# EasyEDA schematic Turbin.json

## Sheets
1 Default_Set: TITLE: Sheet_1; REV: 1.0; Date: 2024-07-22; Sheet: 1/1; Drawn By: ulirberdulham; Company: Your Company
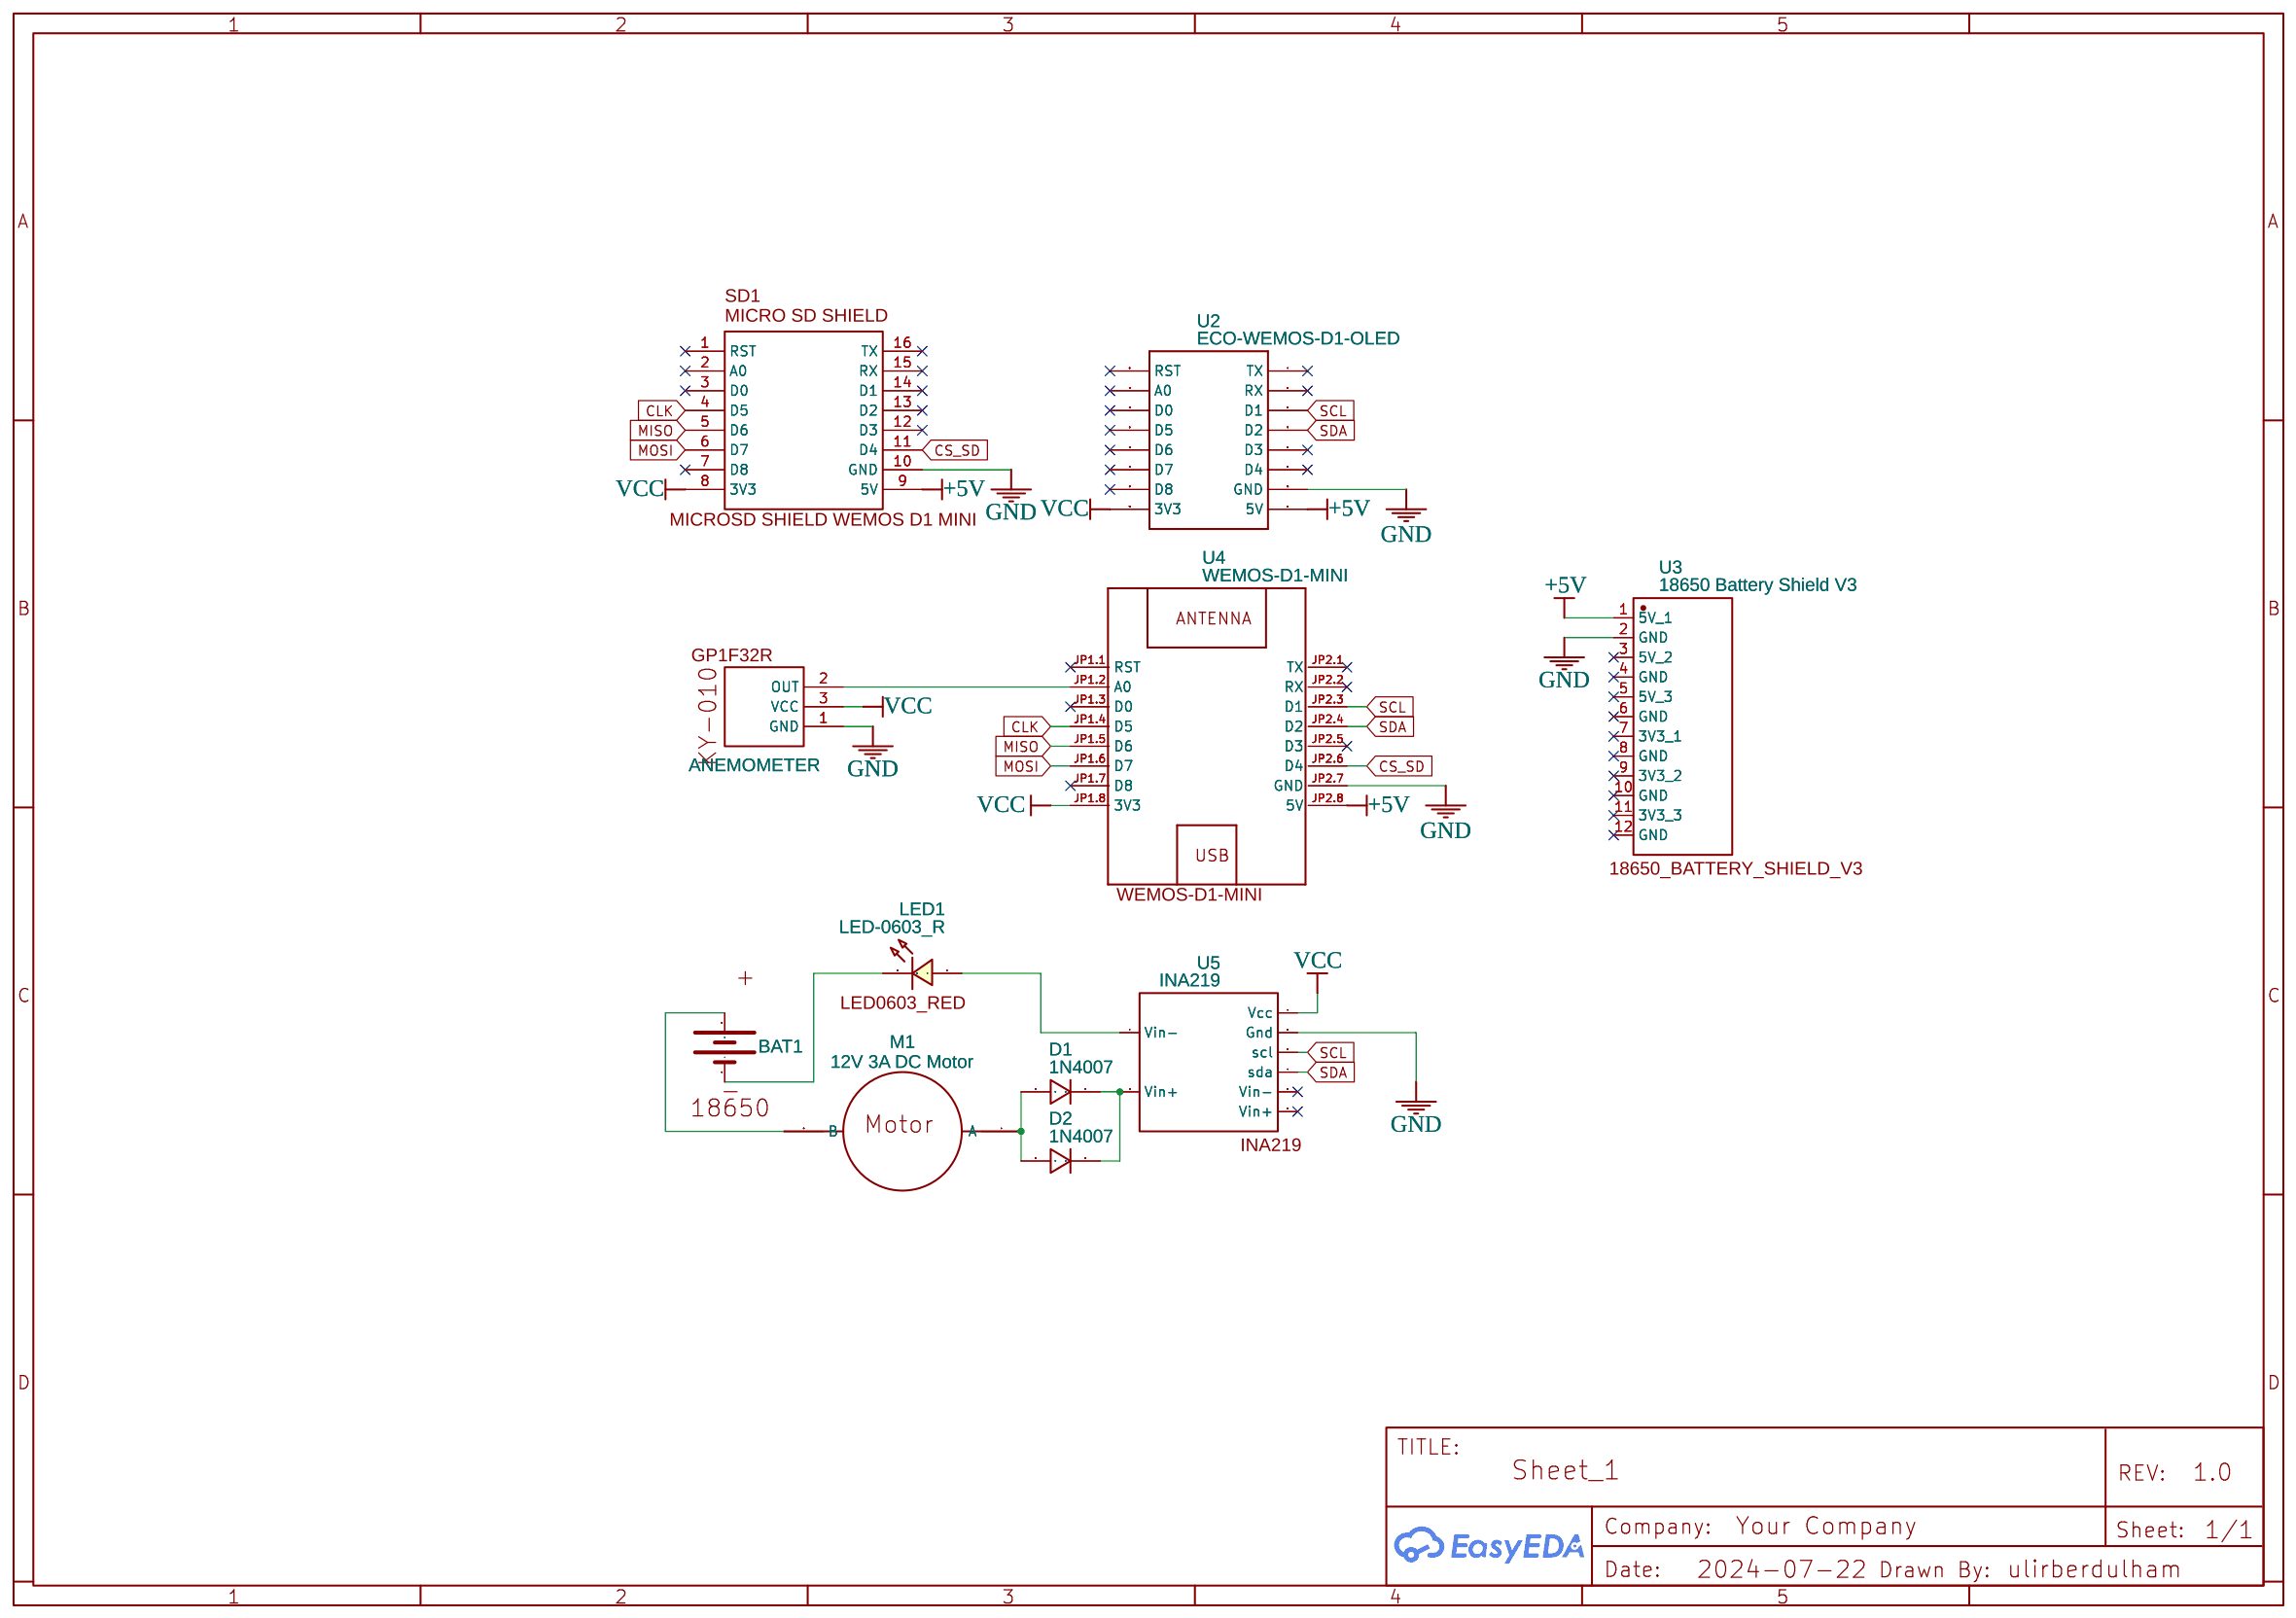
[diagram p0: Default_Set]
2 Board_Hijau: TITLE: Sheet_2; Date: 2024-07-23
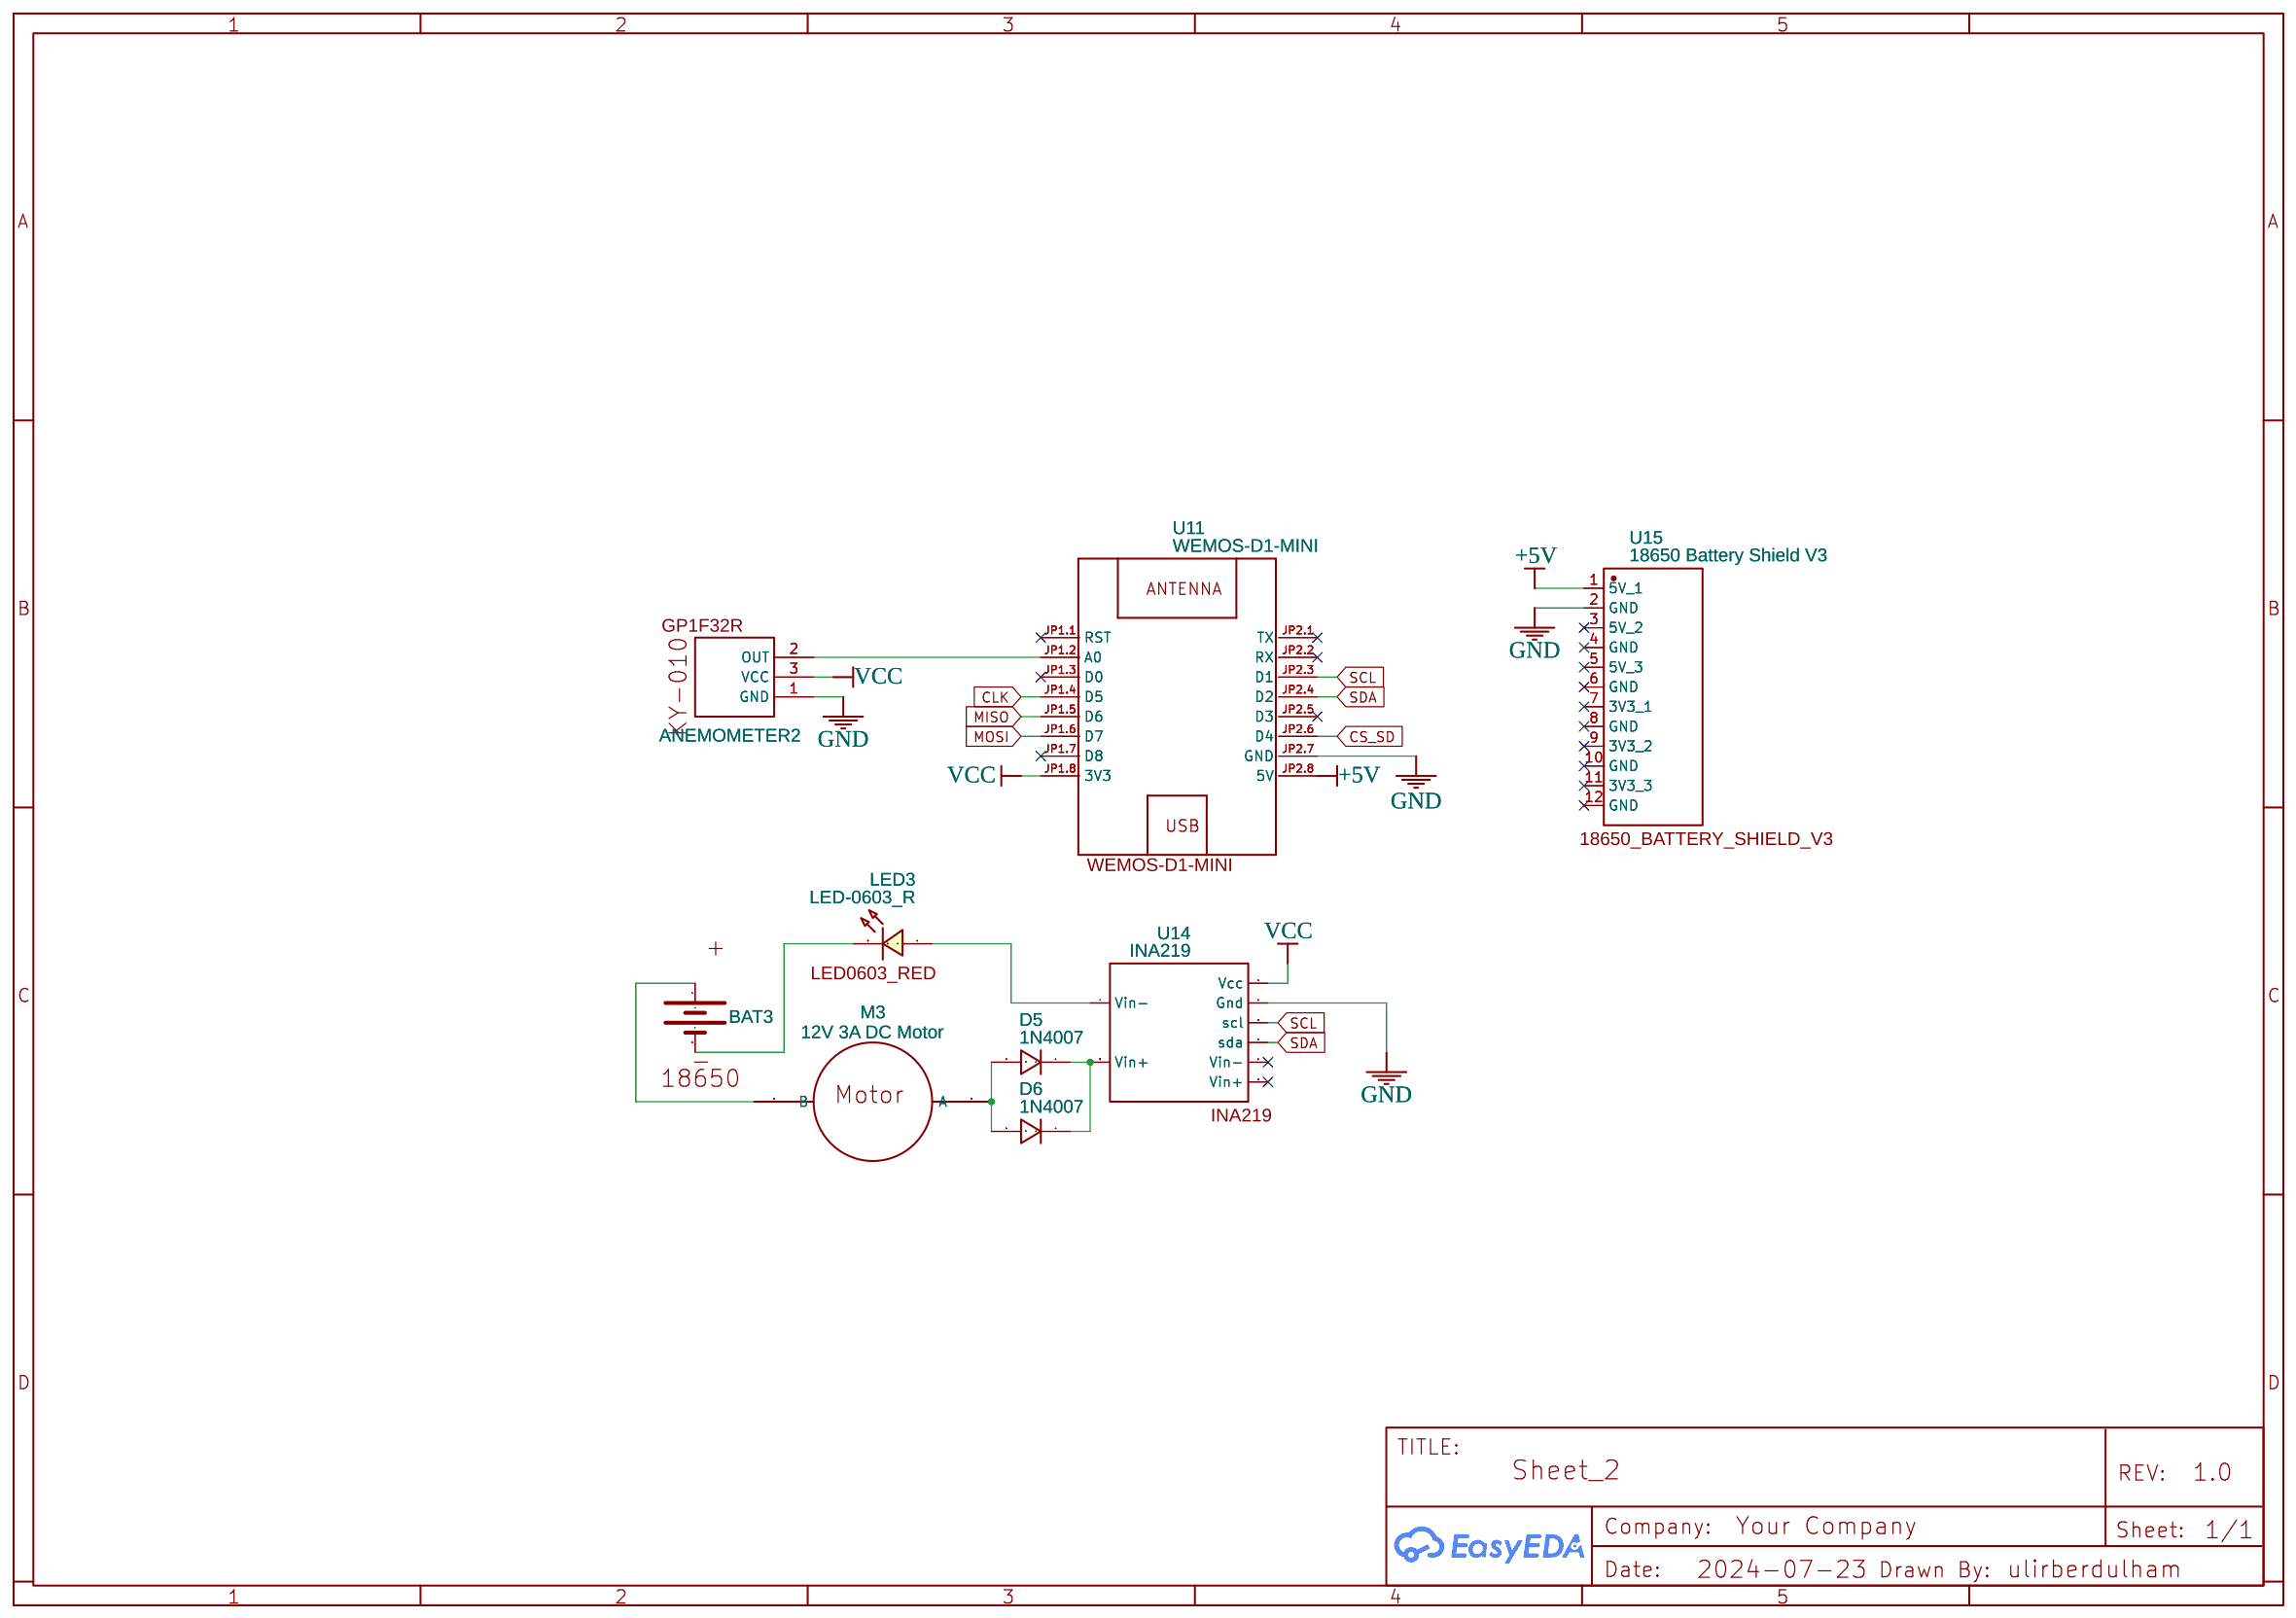
[diagram p1: Board_Hijau]

## Parts
sheet Board_Hijau
ANEMOMETER2  KY-010  [GP1F32R]
BAT3  BATTERY 18650  [ADAFRUIT 18650 BATTERY HOLDER KFLMIAMI420 BH-18650-PC-ND]
D5  1N4007  [DO-41_BD2.4-L4.7-P8.70-D0.9-RD]
D6  1N4007  [DO-41_BD2.4-L4.7-P8.70-D0.9-RD]
LED3  LED-0603_R  [LED0603_RED]
M3  12V 3A DC Motor  [12V 3A  DC MOTOR]
U11  WEMOS-D1-MINI  [WEMOS-D1-MINI]
U14  INA219  [INA219]
U15  18650 Battery Shield V3  [18650_BATTERY_SHIELD_V3]
sheet Default_Set
ANEMOMETER  KY-010  [GP1F32R]
BAT1  BATTERY 18650  [ADAFRUIT 18650 BATTERY HOLDER KFLMIAMI420 BH-18650-PC-ND]
D1  1N4007  [DO-41_BD2.4-L4.7-P8.70-D0.9-RD]
D2  1N4007  [DO-41_BD2.4-L4.7-P8.70-D0.9-RD]
LED1  LED-0603_R  [LED0603_RED]
M1  12V 3A DC Motor  [12V 3A  DC MOTOR]
U1  WEMOS MICROSD CARD SHIELD  [MICROSD SHIELD WEMOS D1 MINI]
U2  ECO-WEMOS-D1-OLED  [ECO-WEMOS-D1-OLED SHIELD]
U3  18650 Battery Shield V3  [18650_BATTERY_SHIELD_V3]
U4  WEMOS-D1-MINI  [WEMOS-D1-MINI]
U5  INA219  [INA219]

## Library data of the parts
ANEMOMETER ANEMOMETER2 = KY-010: Supplier: CHINA (Aliexpress); Contributor: dawidek; Package Display: Yes
BAT1 BAT3 = BATTERY 18650: Contributor: fsergiy; Manufacturer Part: battery; Package Display: No
D1 D2 D5 D6 = 1N4007: Supplier: LCSC; Manufacturer: SEMTECH; Supplier Part: C106903; Contributor: LCEDA_Lib; Package Display: No
LED1 LED3 = LED-0603_R: Manufacturer: EVERLIGHT(台湾亿光); Manufacturer Part: 19-217/R6C-AL1M2VY/3T; Supplier Part: C72044; Supplier: LCSC; Contributor: LCEDA_01; Package Display: Yes
M1 M3 = 12V 3A DC Motor: Contributor: 315151; Package Display: No
U4 U11 = WEMOS-D1-MINI: Contributor: hollandacocobear; Package Display: Yes
U5 U14 = INA219: Contributor: TrikerDK; Package Display: Yes
U3 U15 = 18650 Battery Shield V3: Contributor: Babooon; Package Display: Yes
U1 = WEMOS MICROSD CARD SHIELD: Contributor: QAingenieros; Package Display: Yes
U2 = ECO-WEMOS-D1-OLED: sourceId: YemgaslDx; Contributor: ecoenghk; Package Display: No

## Nets
+5V: U1.9(5V) U2.5V U3.1(5V) U4.JP2.8(5V) U11.JP2.8(5V) U15.1(5V)
GND: ANEMOMETER.1(GND) ANEMOMETER2.1(GND) U1.10(GND) U2.GND U3.2(GND) U4.JP2.7(GND) U5.2(Gnd) U11.JP2.7(GND) U14.2(Gnd) U15.2(GND)
VCC: ANEMOMETER.3(VCC) ANEMOMETER2.3(VCC) U1.8(3V3) U2.3V3 U4.JP1.8(3V3) U5.1(Vcc) U11.JP1.8(3V3) U14.1(Vcc)
CLK: U1.4(D5) U4.JP1.4(D5) U11.JP1.4(D5)
CS_SD: U1.11(D4) U4.JP2.6(D4) U11.JP2.6(D4)
MISO: U1.5(D6) U4.JP1.5(D6) U11.JP1.5(D6)
MOSI: U1.6(D7) U4.JP1.6(D7) U11.JP1.6(D7)
SCL: U2.D1 U4.JP2.3(D1) U5.3(scl) U11.JP2.3(D1) U14.3(scl)
SDA: U2.D2 U4.JP2.4(D2) U5.4(sda) U11.JP2.4(D2) U14.4(sda)
Net-(ANEMOMETER2-2): ANEMOMETER2.2(OUT) U11.JP1.2(A0)
Net-(ANEMOMETER-2): ANEMOMETER.2(OUT) U4.JP1.2(A0)
Net-(BAT1-1): BAT1.1(+) M1.2(B)
Net-(BAT1-2): BAT1.2(-) LED1.2
Net-(BAT3-1): BAT3.1(+) M3.2(B)
Net-(BAT3-2): BAT3.2(-) LED3.2
Net-(D1-1): D1.1 D2.1 U5.8(Vin+)
Net-(D1-2): D1.2 D2.2 M1.1(A)
Net-(D5-1): D5.1 D6.1 U14.8(Vin+)
Net-(D5-2): D5.2 D6.2 M3.1(A)
Net-(LED1-1): LED1.1 U5.7(Vin-)
Net-(LED3-1): LED3.1 U14.7(Vin-)

Not connected (* = marked no-connect by the designer): U1 1(RST)* 2(A0)* 3(D0)* 7(D8)* 12(D3)* 13(D2)* 14(D1)* 15(RX)* 16(TX)*; U2 A0* D0* D3* D4* D5* D6* D7* D8* RST* RX* TX*; U3 3(5V_2)* 4(GND)* 5(5V_3)* 6(GND)* 7(3V3_1)* 8(GND)* 9(3V3_2)* 10(GND)* 11(3V3_3)* 12(GND)*; U4 JP1.1(RST)* JP1.3(D0)* JP1.7(D8)* JP2.1(TX)* JP2.2(RX)* JP2.5(D3)*; U5 5(Vin-)* 6(Vin+)*; U11 JP1.1(RST)* JP1.3(D0)* JP1.7(D8)* JP2.1(TX)* JP2.2(RX)* JP2.5(D3)*; U14 5(Vin-)* 6(Vin+)*; U15 3(5V_2)* 4(GND)* 5(5V_3)* 6(GND)* 7(3V3_1)* 8(GND)* 9(3V3_2)* 10(GND)* 11(3V3_3)* 12(GND)*
